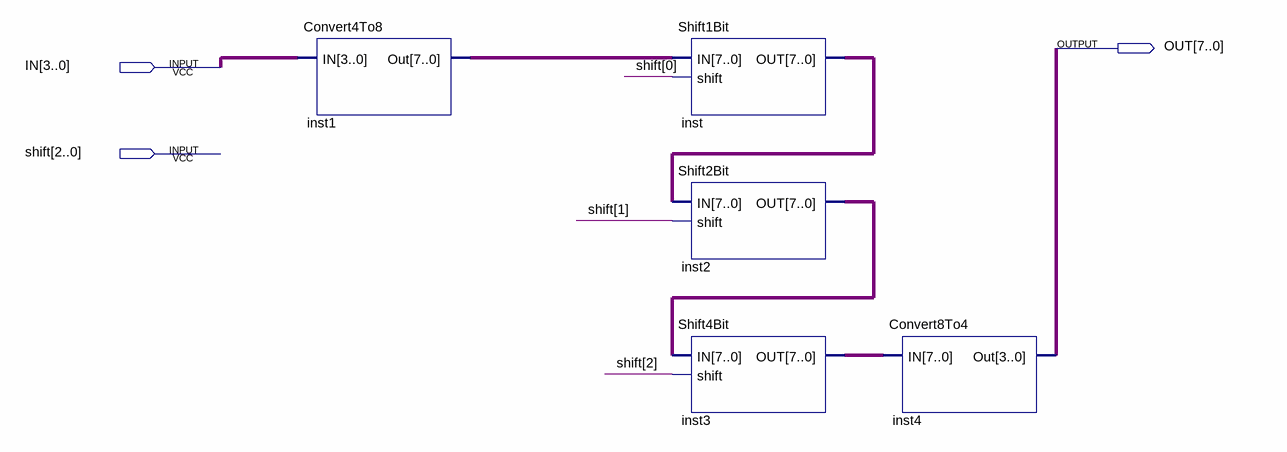
[diagram p0: schematic sheet]
// Quartus schematic Shift4Bit.bdf as structural Verilog: 5 symbols, 3 pins
module Shift4Bit (
  input  [3:0] IN,
  input  [2:0] shift,
  output [7:0] OUT
);

  wire [7:0] inst1_out, inst2_out, inst3_out, inst_out;

  Convert4To8 inst1 (.IN(IN), .Out(inst1_out));
  Shift1Bit inst (.IN(inst1_out), .shift(shift[0]), .OUT(inst_out));
  Shift2Bit inst2 (.IN(inst_out), .shift(shift[1]), .OUT(inst2_out));
  Shift4Bit inst3 (.IN(inst2_out), .shift(shift[2]), .OUT(inst3_out));
  Convert8To4 inst4 (.IN(inst3_out), .Out(OUT));
endmodule
